# EAGLE design testboard (EAGLE 6.6.0)
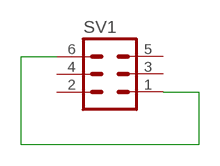
[diagram p0: schematic, sheet 1]

## Parts
SV1  MA03-2W  [MA03-2W]

## Nets
N$1: SV1.1 SV1.6
Unconnected: SV1.2 SV1.3 SV1.4 SV1.5

## Library data of the parts
SV1 = SuperFeed:MA03-2W: PIN HEADER

## Board
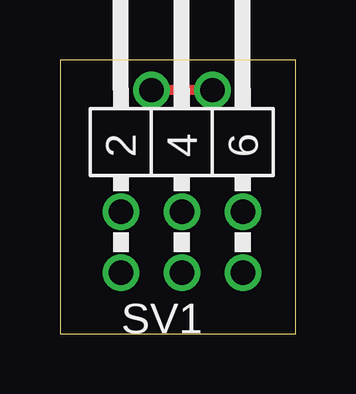
[diagram p1: board, top side]
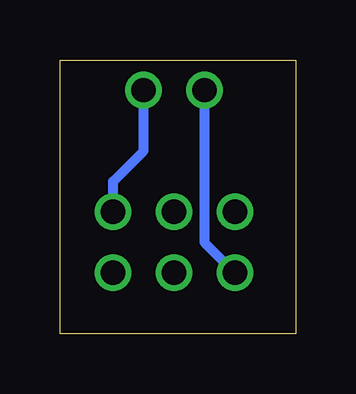
[diagram p2: board, bottom side, seen from below]

Size 9.83 x 11.42 mm. Coordinates in mm from the lower left corner, seen from the top.
Outline: 0,0 9.83,0 9.83,11.42 0,11.42 0,0
Copper layers (1*16): Top 0.035mm / dielectric 1.5mm / Bottom 0.035mm
Design rules "default": minimum track width 10mil, minimum drill 24mil, track to track 8mil, track to pad 8mil, pad to pad 8mil, via to via 8mil, smd to smd 8mil, copper to edge 40mil, drill to drill 8mil, minimum pad ring 10mil, minimum via ring 8mil, stop-mask expansion 4mil, vias tented up to drill 0mil, thermal gap 10mil

### Footprints (pad centres in the part's own frame; a part is rotated, then mirrored left to right if it is on the bottom)
MA03-2W = drill 1.016: 1 -2.54,-1.27; 2 -2.54,1.27; 3 0,-1.27; 4 0,1.27; 5 2.54,-1.27; 6 2.54,1.27

### Placement (x,y rotation side)
SV1  5.08,3.81 0 top

### Tracks (layer width: path | path; a pad name or v marks a point on that pad's centre or on a via)
N$1  (via drill 1.02)
  Top 0.406: v6.35,10.16 v3.81,10.16
  Bottom 0.406: SV1.6 7.62,6.35 6.35,7.62 v6.35,10.16 | v3.81,10.16 3.81,3.81 SV1.1